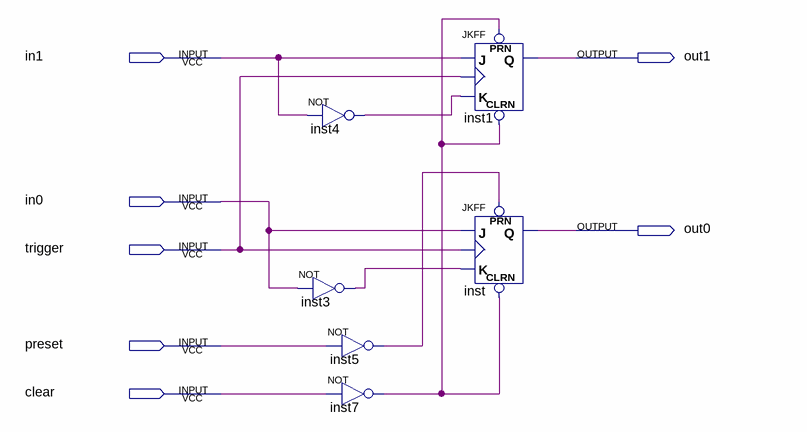
[diagram p0: schematic sheet]
// Quartus schematic registrador.bdf as structural Verilog: 6 symbols, 7 pins
module registrador (
  input  in1,
  input  in0,
  input  trigger,
  input  preset,
  input  clear,
  output out1,
  output out0
);

  wire inst3_out, inst4_out, inst5_out, inst7_out;

  not inst4 (inst4_out, in1);
  not inst3 (inst3_out, in0);
  not inst5 (inst5_out, preset);
  not inst7 (inst7_out, clear);
  JKFF inst1 (.PRN(inst7_out), .CLRN(inst7_out), .K(inst4_out), .J(in1), .CLK(trigger), .Q(out1));
  JKFF inst (.PRN(inst5_out), .CLRN(inst7_out), .K(inst3_out), .J(in0), .CLK(trigger), .Q(out0));
endmodule
